# EasyEDA Pro project MiniVolter.eprj

# Schematic Schematic1
Board Name: Board1; Create Date: 2026-08-12; Page Name: P1; Project Name: MiniVolter; Schematic Name: Schematic1; Update Date: 2026-08-12; Company: EasyEDA.com; Page Size: A4; Version: V1.0
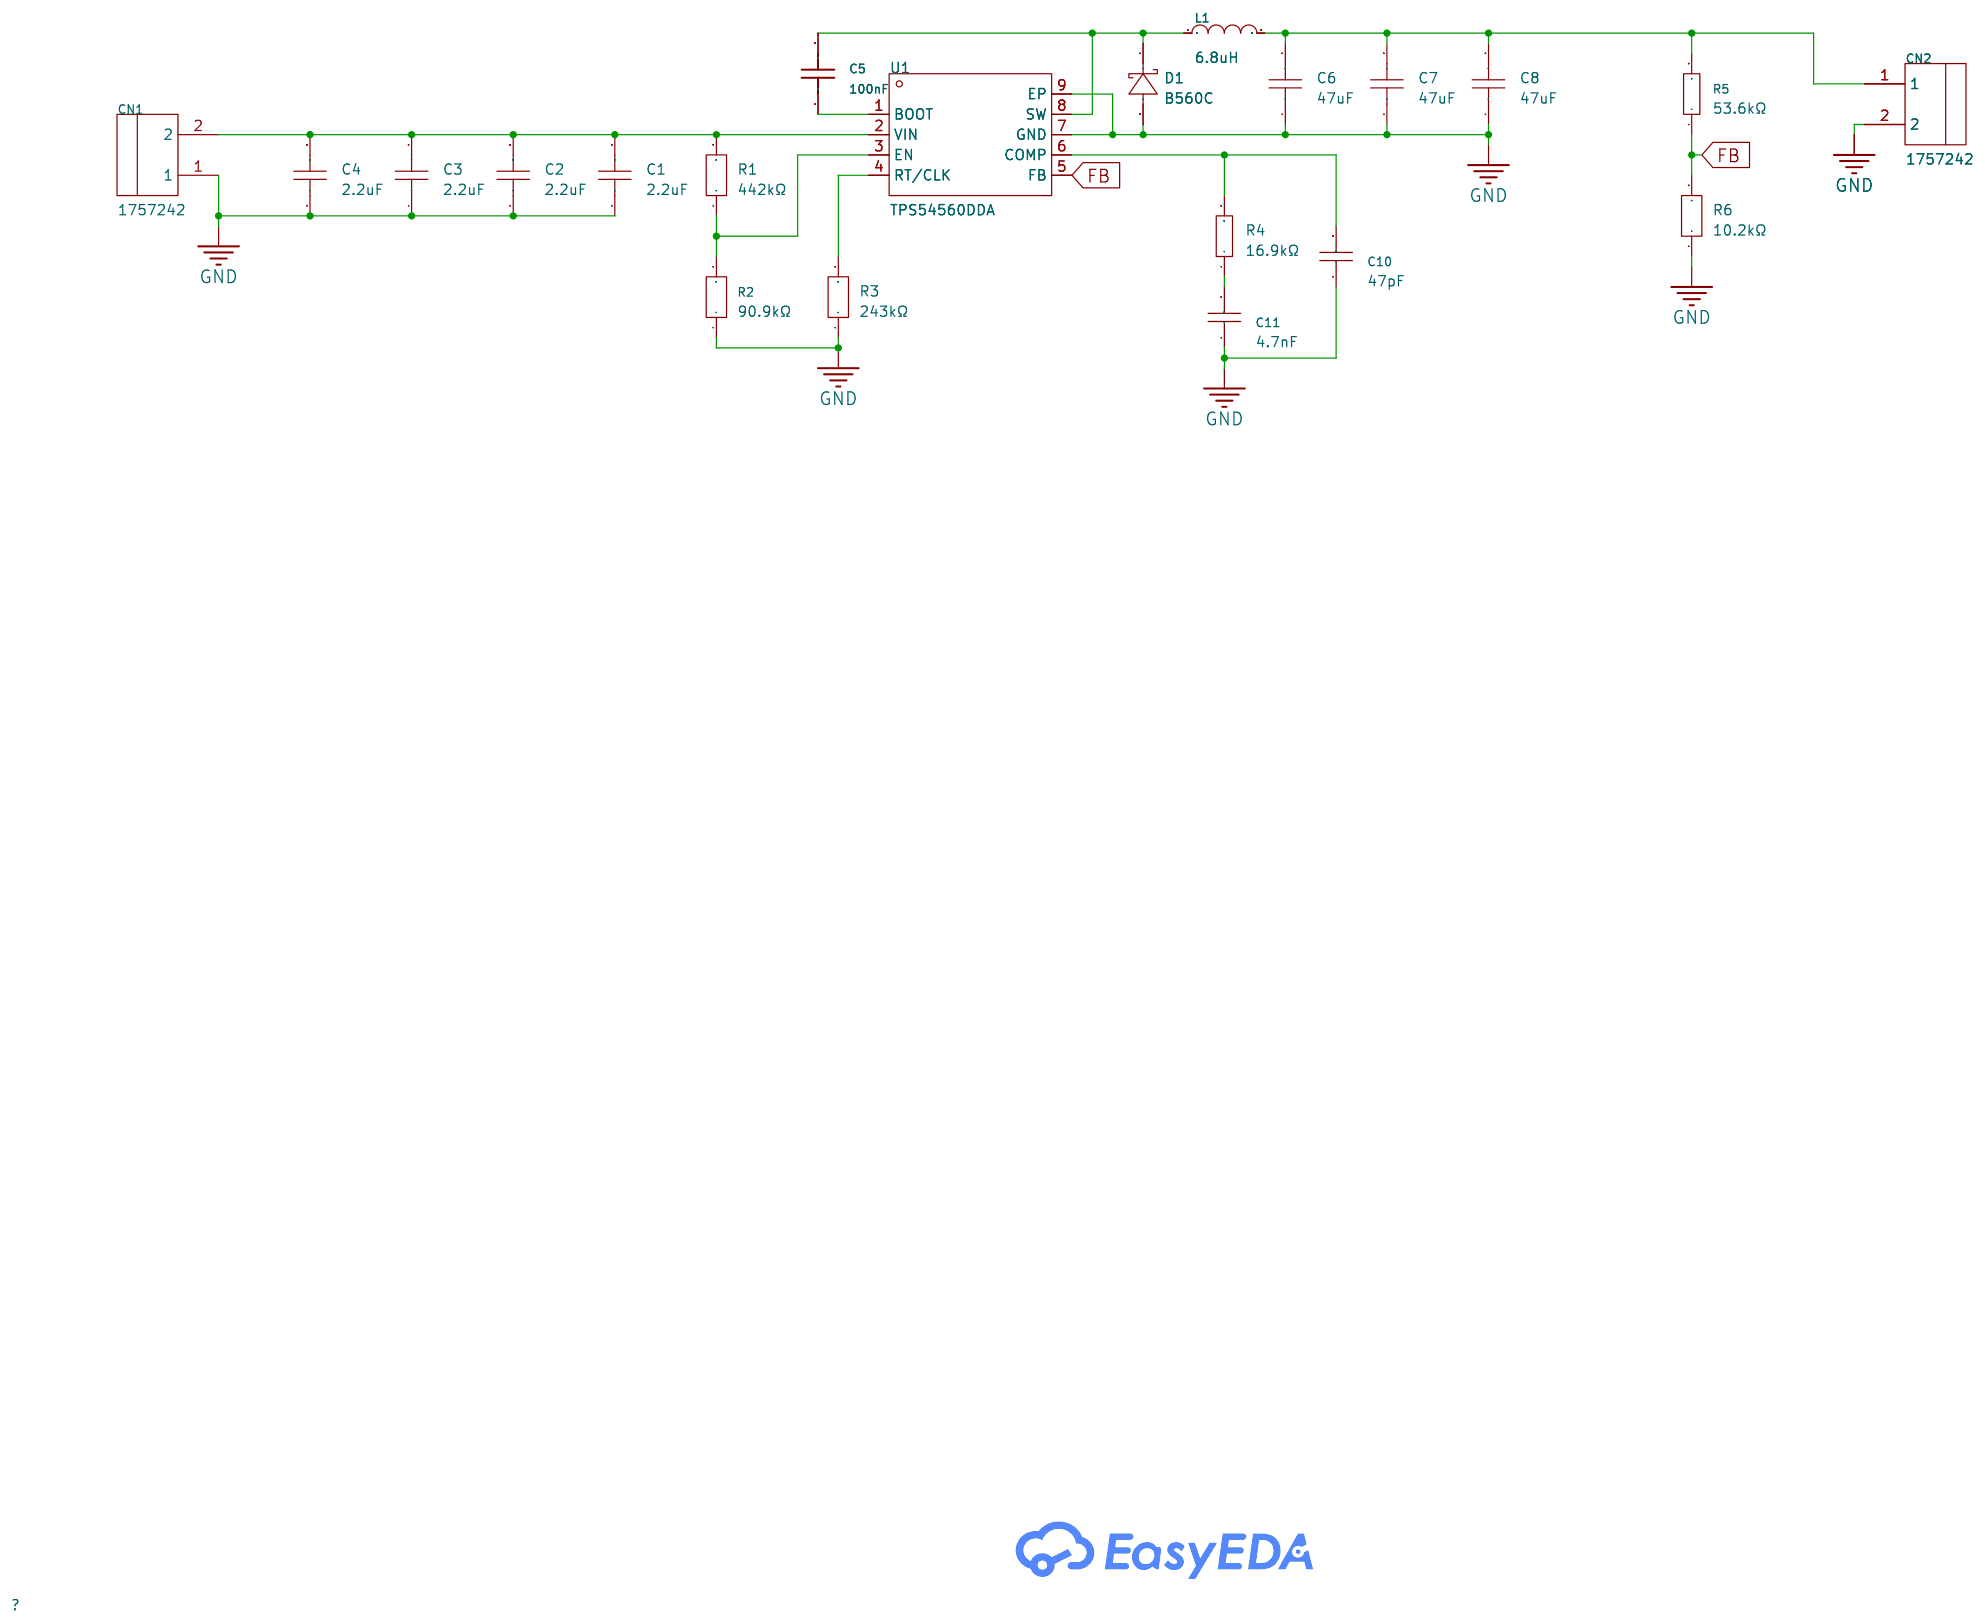
[diagram p0: schematic sheet]

## Parts
C1  2.2uF  [C1206]
C2  2.2uF  [C1206]
C3  2.2uF  [C1206]
C4  2.2uF  [C1206]
C5  100nF  [C0603]
C6  47uF  [C1210]
C7  47uF  [C1210]
C8  47uF  [C1210]
C10  47pF  [C0603]
C11  4.7nF  [C0603]
CN1  1757242  [CONN-TH_2P-P5.08_1757242]
CN2  1757242  [CONN-TH_2P-P5.08_1757242]
D1  B560C  [SMC_L6.9-W5.9-LS7.9-RD]
L1  6.8uH  [IND-SMD_L6.5-W6.5_VISHAY]
R1  442kΩ  [R0805]
R2  90.9kΩ  [R0603]
R3  243kΩ  [R0603]
R4  16.9kΩ  [R0603]
R5  53.6kΩ  [R0603]
R6  10.2kΩ  [R0603]
U1  TPS54560DDA  [SO-8_L4.9-W3.9-P1.27-LS6.0-BL-EP]

## Library data of the parts
C1-C4 = CC1206KKX7R0BB225: Capacitance:2.2uF Tolerance:±10% Tolerance:±10% Voltage Rating:100V Temperature Coefficient:X7R; LCSC Part Name: 2.2uF ±10% 100V; Supplier Part: C577211; Manufacturer: YAGEO(国巨); Supplier Footprint: 1206; JLCPCB Part Class: Extended Part; Datasheet: https://item.szlcsc.com/datasheet/CC1206KKX7R0BB225/604702.html; Supplier: LCSC; Tolerance: ±10%; Voltage Rating: 100V; Temperature Coefficient: X7R; Check: true
C5 = CC0603KRX7R9BB104: Capacitance:100nF Tolerance:±10% Tolerance:±10% Voltage Rating:50V Temperature Coefficient:X7R; LCSC Part Name: 100nF ±10% 50V; Supplier Part: C14663; Manufacturer: YAGEO(国巨); Supplier Footprint: 0603; JLCPCB Part Class: Basic Part; Datasheet: https://item.szlcsc.com/datasheet/CC0603KRX7R9BB104/15331.html; Supplier: LCSC; Tolerance: ±10%; Voltage Rating: 50V; Temperature Coefficient: X7R; Check: true
C6-C8 = HGC1210R5476M250NSVK: Capacitance:47uF Tolerance:±20% Tolerance:±20% Voltage Rating:25V Temperature Coefficient:X5R; LCSC Part Name: 47uF ±20% 25V; Supplier Part: C7432791; Manufacturer: Chinocera(华瓷); Supplier Footprint: 1210; JLCPCB Part Class: Extended Part; Datasheet: https://item.szlcsc.com/datasheet/HGC1210R5476M250NSVK/8438273.html; Supplier: LCSC; Tolerance: ±20%; Voltage Rating: 25V; Temperature Coefficient: X5R; Check: true
C10 = CC0603JRNPO9BN470: Capacitance:47pF Tolerance:±5% Tolerance:±5% Voltage Rating:50V Temperature Coefficient:NP0; LCSC Part Name: 47pF ±5% 50V; Supplier Part: C105622; Manufacturer: YAGEO(国巨); Supplier Footprint: 0603; JLCPCB Part Class: Extended Part; Datasheet: https://item.szlcsc.com/datasheet/CC0603JRNPO9BN470/106837.html; Supplier: LCSC; Tolerance: ±5%; Voltage Rating: 50V; Temperature Coefficient: NP0; Check: true
C11 = CL10B472KB8NNNC: Capacitance:4.7nF Tolerance:±10% Tolerance:±10% Voltage Rating:50V Temperature Coefficient:X7R; LCSC Part Name: 4.7nF ±10% 50V; Supplier Part: C1621; Manufacturer: SAMSUNG(三星); Supplier Footprint: 0603; JLCPCB Part Class: Extended Part; Datasheet: https://item.szlcsc.com/datasheet/CL10B472KB8NNNC/1973.html; Supplier: LCSC; Tolerance: ±10%; Voltage Rating: 50V; Temperature Coefficient: X7R; Check: true
CN1 CN2 = 1757242: Connector Type:Board Side/Socket - Closed Number of Positions or Pins:1x2P Pitch:5.08mm Color:Green Mounting Type:Right-Angle Number of Pins:2P Number of Rows:1 Number of PINs Per Row:2 Current Rating:15A Voltage Rating (Max):300V Operating Temperature:-; LCSC Part Name: 1x2P 5.08mm 排数:1 每排P数:2; Supplier Part: C90074; Manufacturer: Phoenix Contact(菲尼克斯); Supplier Footprint: 弯插,P=5.08mm; JLCPCB Part Class: Extended Part; Datasheet: https://item.szlcsc.com/datasheet/1757242/91259.html; Supplier: LCSC; Connector Type: Board Side/Socket - Closed; Number of Positions or Pins: 1x2P; Pitch: 5.08mm; Color: Green; Mounting Type: Right-Angle; Number of Pins: 2P; Number of Rows: 1; Number of PINs Per Row: 2; Current Rating: 15A; Voltage Rating (Max): 300V; Check: true
D1 = B560C_C6807784: Diode Configuration:Independent Voltage - Forward(Vf@If):700mV@5A Voltage - DC Reverse(Vr):60V Current - Rectified:5A Reverse Leakage Current (Ir):100uA@60V Operating Junction Temperature Range:-55℃~+150℃ Operating Junction Temperature Range:-55℃~+150℃; LCSC Part Name: 电压:60V 电流:5A; Supplier Part: C6807784; Manufacturer: FUXINSEMI(富芯森美); Supplier Footprint: SMC(DO-214AB); JLCPCB Part Class: Extended Part; Datasheet: https://item.szlcsc.com/datasheet/B560C/7769272.html; Supplier: LCSC; Diode Configuration: Independent; Voltage - Forward(Vf@If): 700mV@5A; Voltage - DC Reverse(Vr): 60V; Current - Rectified: 5A; Reverse Leakage Current (Ir): 100uA@60V; Operating Junction Temperature Range: -55℃~+150℃; Check: true
L1 = IHLP2525CZER6R8M01: Inductance: Tolerance:±20% Tolerance:±20% Rated Current: Saturation Current (Isat):8A DC Resistance (DCR): Type:- Ratings:-; LCSC Part Name: 6.8uH ±20% 8A; Supplier Part: C506575; Manufacturer: VISHAY(威世); Supplier Footprint: SMD,6.5x6.9mm; JLCPCB Part Class: Extended Part; Datasheet: https://atta.szlcsc.com/upload/public/pdf/source/20210401/C506575_71387701A40E754D8D9F35C81B417BBD.pdf; Supplier: LCSC; Tolerance: ±20%; Saturation Current (Isat): 8A; Check: true
R1 = FRC0805F4423TS: Type:Thick Film Resistor Resistance:442kΩ Tolerance:±1% Tolerance:±1% Power(Watts):125mW Voltage-Supply(Max):150V Temperature Coefficient:±100ppm/℃ Temperature Coefficient:±100ppm/℃ Operating Temperature:-55℃~+155℃ Operating Temperature:-55℃~+155℃; LCSC Part Name: 442kΩ ±1% 125mW 厚膜电阻; Supplier Part: C2999502; Manufacturer: FOJAN(富捷); Supplier Footprint: 0805; JLCPCB Part Class: Extended Part; Datasheet: https://item.szlcsc.com/datasheet/FRC0805F4423TS/3476942.html; Supplier: LCSC; Type: Thick Film Resistor; Tolerance: ±1%; Power(Watts): 125mW; Voltage-Supply(Max): 150V; Temperature Coefficient: ±100ppm/℃; Operating Temperature: -55℃~+155℃; Check: true
R2 = ERJ3EKF9092V: Type:Thick Film Resistor Resistance:90.9kΩ Tolerance:±1% Tolerance:±1% Power(Watts):100mW Voltage-Supply(Max):150V Temperature Coefficient:±100ppm/℃ Temperature Coefficient:±100ppm/℃ Operating Temperature:-55℃~+155℃ Operating Temperature:-55℃~+155℃; LCSC Part Name: 90.9kΩ ±1% 100mW 厚膜电阻; Supplier Part: C403390; Manufacturer: PANASONIC(松下); Supplier Footprint: 0603; JLCPCB Part Class: Extended Part; Datasheet: https://item.szlcsc.com/datasheet/ERJ3EKF9092V/389189.html; Supplier: LCSC; Type: Thick Film Resistor; Tolerance: ±1%; Power(Watts): 100mW; Voltage-Supply(Max): 150V; Temperature Coefficient: ±100ppm/℃; Operating Temperature: -55℃~+155℃; Check: true
R3 = FRC0603F2433TS: Type:Thick Film Resistor Resistance:243kΩ Tolerance:±1% Tolerance:±1% Power(Watts):100mW Voltage-Supply(Max):75V Temperature Coefficient:±100ppm/℃ Temperature Coefficient:±100ppm/℃ Operating Temperature:-55℃~+155℃ Operating Temperature:-55℃~+155℃; LCSC Part Name: 厚膜电阻 243kΩ ±1% 100mW; Supplier Part: C7467321; Manufacturer: FOJAN(富捷); Supplier Footprint: 0603; JLCPCB Part Class: Extended Part; Datasheet: https://item.szlcsc.com/datasheet/FRC0603F2433TS/8513937.html; Supplier: LCSC; Type: Thick Film Resistor; Tolerance: ±1%; Power(Watts): 100mW; Voltage-Supply(Max): 75V; Temperature Coefficient: ±100ppm/℃; Operating Temperature: -55℃~+155℃; Check: true
R4 = 0603WAF1692T5E: Type:Thick Film Resistor Resistance:16.9kΩ Tolerance:±1% Tolerance:±1% Power(Watts):100mW Voltage-Supply(Max):75V Temperature Coefficient:±100ppm/℃ Temperature Coefficient:±100ppm/℃ Operating Temperature:-55℃~+155℃ Operating Temperature:-55℃~+155℃; LCSC Part Name: 16.9kΩ ±1% 100mW 厚膜电阻; Supplier Part: C25954; Manufacturer: UNI-ROYAL(厚声); Supplier Footprint: 0603; JLCPCB Part Class: Extended Part; Datasheet: https://item.szlcsc.com/datasheet/0603WAF1692T5E/26697.html; Supplier: LCSC; Type: Thick Film Resistor; Tolerance: ±1%; Power(Watts): 100mW; Voltage-Supply(Max): 75V; Temperature Coefficient: ±100ppm/℃; Operating Temperature: -55℃~+155℃; Check: true
R5 = 0603WAF5362T5E: Type:Thick Film Resistor Resistance:53.6kΩ Tolerance:±1% Tolerance:±1% Power(Watts):100mW Voltage-Supply(Max):75V Temperature Coefficient:±100ppm/℃ Temperature Coefficient:±100ppm/℃ Operating Temperature:-55℃~+155℃ Operating Temperature:-55℃~+155℃; LCSC Part Name: 53.6kΩ ±1% 100mW 厚膜电阻; Supplier Part: C23074; Manufacturer: UNI-ROYAL(厚声); Supplier Footprint: 0603; JLCPCB Part Class: Extended Part; Datasheet: https://item.szlcsc.com/datasheet/0603WAF5362T5E/23801.html; Supplier: LCSC; Type: Thick Film Resistor; Tolerance: ±1%; Power(Watts): 100mW; Voltage-Supply(Max): 75V; Temperature Coefficient: ±100ppm/℃; Operating Temperature: -55℃~+155℃; Check: true
R6 = FRC0603F1022TS: Type:Thick Film Resistor Resistance:10.2kΩ Tolerance:±1% Tolerance:±1% Power(Watts):100mW Voltage-Supply(Max):75V Temperature Coefficient:±100ppm/℃ Temperature Coefficient:±100ppm/℃ Operating Temperature:-55℃~+155℃ Operating Temperature:-55℃~+155℃; LCSC Part Name: 10.2kΩ ±1% 100mW 厚膜电阻; Supplier Part: C2933125; Manufacturer: FOJAN(富捷); Supplier Footprint: 0603; JLCPCB Part Class: Extended Part; Supplier: LCSC; Type: Thick Film Resistor; Tolerance: ±1%; Power(Watts): 100mW; Voltage-Supply(Max): 75V; Temperature Coefficient: ±100ppm/℃; Operating Temperature: -55℃~+155℃; Check: true
U1 = TPS54560DDA: Function:Step-down type Voltage - Supply:4.5V~60V Voltage - Supply:4.5V~60V Output Voltage:800mV~58.8V Output Voltage:800mV~58.8V Output Current:5A Frequency - Switching:2.5MHz Frequency - Switching:2.5MHz Operating Temperature:-40℃~+150℃@(TJ) Operating T; LCSC Part Name: 降压型 5A 4.5V~60V; Supplier Part: C465738; Manufacturer: TI(德州仪器); Supplier Footprint: SO-8-EP; JLCPCB Part Class: Extended Part; Datasheet: https://www.ti.com/cn/lit/gpn/tps54560; Supplier: LCSC; Function: Step-down type; Voltage - Supply: 4.5V~60V; Output Voltage: 800mV~58.8V; Output Current: 5A; Frequency - Switching: 2.5MHz; Operating Temperature: -40℃~+150℃@(TJ); Synchronous Rectifier: No; Number of Outputs: 1; Topology: Buck; Quiescent Current: 146uA; Switch tube (built-in/external): Built-in; Output Type: Adjustable; Features: Light load efficient mode；External compensation；Frequency synchronization；Cycle-by-cycle current limiting; Check: true

## Nets
GND: C1.1 C2.1 C3.1 C4.1 C6.1 C7.1 C8.1 C10.1 C11.1 CN1.1 CN2.2 D1.2(A) R2.1 R3.1 R6.1 U1.7(GND) U1.9(EP)
FB: R5.1 R6.2 U1.5(FB)
$1N1641: C1.2 C2.2 C3.2 C4.2 CN1.2 R1.2 U1.2(VIN)
$1N1678: R1.1 R2.2 U1.3(EN)
$1N1699: R3.2 U1.4(RT/CLK)
$1N1756: C5.1 U1.1(BOOT)
$1N1862: C5.2 D1.1(K) L1.1 U1.8(SW)
$1N2055: C10.2 R4.2 U1.6(COMP)
$1N2081: C11.2 R4.1
$1N2317: C6.2 C7.2 C8.2 CN2.1 L1.2 R5.2

# Board PCB1
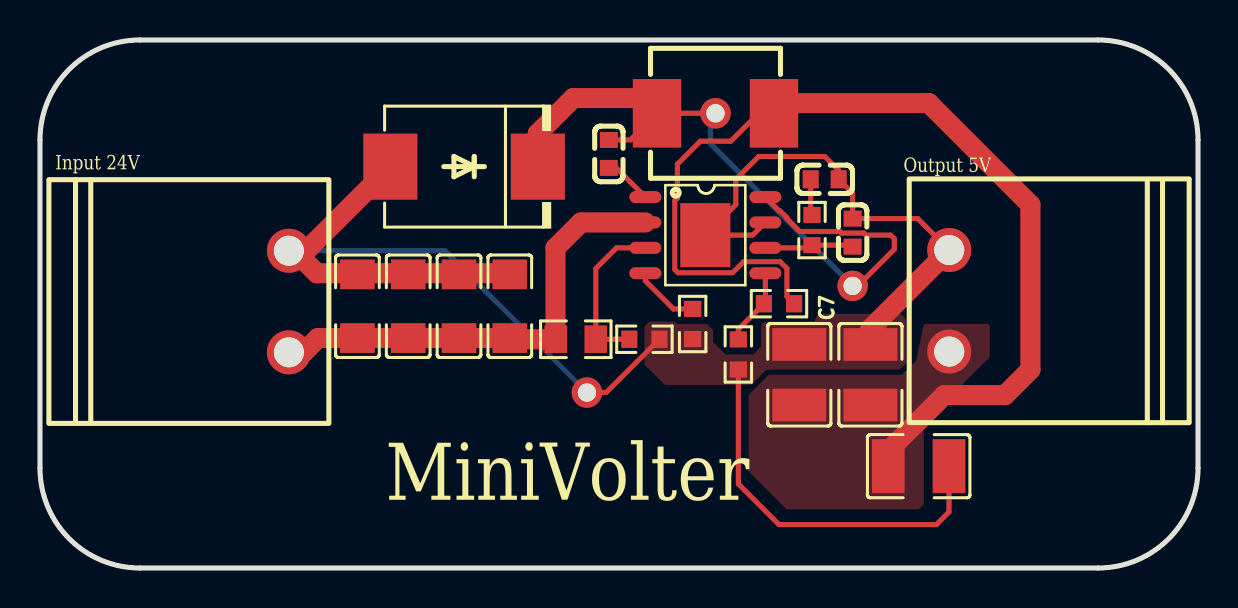
[diagram p1: board, top side]
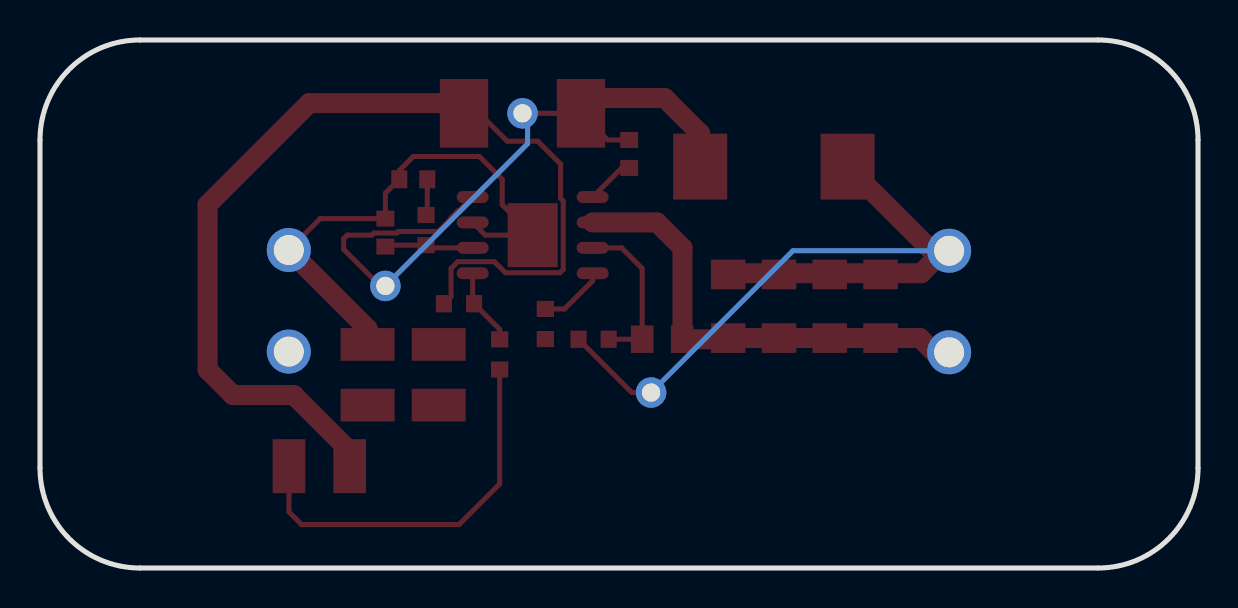
[diagram p2: board, bottom side, seen from below]

Outline 57.91 x 26.42 mm; copper layers: Top Layer, Bottom Layer. Coordinates in mm from the lower left corner of the outline.
Outline path: 0,21.42 0,5 arc(1.46,1.46) 5,0 52.91,0 arc(56.45,1.46) 57.91,5 57.91,21.42 arc(56.45,24.95) 52.91,26.42 5,26.42 arc(1.46,24.95) 0,21.42
Stack: Top Layer 0.035mm / Dielectric1 1.51mm FR4 er 4.5 / Bottom Layer 0.035mm

## Design rules (mm)
template: Custom Config
spacing copperThickness1oz (default): track to track 0.102, other pairs 0.152 to 0.3
spacing copperThickness2oz: track to track 0.203, other pairs 0.152 to 0.3
track width copperThickness1oz (default): min 0.127, default 0.254, max 2.54
track width copperThickness2oz: min 0.203, default 0.254, max 2.54
differential pair differentialPair (default): width min 0.127, default 0.254, max 2.54; gap min 0.152, default 0.152
via viaSize (default): diameter min 0.5, default 0.61, max 10; hole min 0.3, default 0.305, max 6.3
net GND uses copperRegion1

## Placement (name value [footprint] x y rotation side)
C1  2.2uF  [C1206]  23.5 13.1 270 top
C2  2.2uF  [C1206]  20.96 13.1 270 top
C3  2.2uF  [C1206]  18.41 13.1 270 top
C4  2.2uF  [C1206]  15.88 13.1 270 top
C5  100nF  [C0603]  28.45 20.72 90 top
C6  47uF  [C1210]  41.53 9.67 270 top
C7  47uF  [C1210]  37.97 9.67 270 top
C8  47uF  [C1210]  43.94 5.09 180 top
C10  47pF  [C0603]  40.64 16.78 270 top
C11  4.7nF  [C0603]  39.24 19.45 180 top
CN1  1757242  [CONN-TH_2P-P5.08_1757242]  12.45 13.33 270 top
CN2  1757242  [CONN-TH_2P-P5.08_1757242]  45.47 13.37 90 top
D1  B560C  [SMC_L6.9-W5.9-LS7.9-RD]  21.21 20.08 180 top
L1  6.8uH  [IND-SMD_L6.5-W6.5_VISHAY]  33.78 22.75 0 top
NOREF  -  [Pad_e252]  27.35 8.78 0 top
NOREF#2  -  [Pad_e364]  33.78 22.75 0 top
NOREF#3  -  [Pad_e296]  40.64 14.11 0 top
R1  442kΩ  [R0805]  26.8 11.45 180 top
R2  90.9kΩ  [R0603]  30.23 11.45 180 top
R3  243kΩ  [R0603]  32.64 12.21 90 top
R4  16.9kΩ  [R0603]  38.61 16.91 270 top
R5  53.6kΩ  [R0603]  36.96 13.22 0 top
R6  10.2kΩ  [R0603]  34.93 10.68 90 top
U1  TPS54560DDA  [SO-8_L4.9-W3.9-P1.27-LS6.0-BL-EP]  33.27 16.65 270 top

## Footprints (pads in the part's own frame, mm; a bottom-side part is the same pattern mirrored in y, then rotated)
C0603
  rect 0.8x0.9 smd: 1(-0.7,0) 2(0.7,0)
C1206
  rect 1.485x1.728 smd: 1(-1.593,0) 2(1.593,0)
C1210
  rect 1.635x2.7 smd: 1(-1.518,0) 2(1.518,0)
CONN-TH_2P-P5.08_1757242
  round 2.2 hole 1.5: 1(-2.54,0) 2(2.54,0)
IND-SMD_L6.5-W6.5_VISHAY
  rect 2.42x3.43 smd: 1(-2.925,0) 2(2.925,0)
Pad_e252
  round 1.524 hole 0.914: 1(0,0)
Pad_e296
  round 1.524 hole 0.914: 1(0,0)
Pad_e364
  round 1.524 hole 0.914: 1(0,0)
R0603
  rect 0.806x0.864 smd: 1(-0.753,0) 2(0.753,0)
R0805
  rect 1.133x1.377 smd: 1(-1,0) 2(1,0)
SMC_L6.9-W5.9-LS7.9-RD
  rect 2.7x3.3 smd: 1(-3.687,0) 2(3.687,0)
SO-8_L4.9-W3.9-P1.27-LS6.0-BL-EP
  oval 0.6x1.6 smd: 1(-1.905,-3) 2(-0.635,-3) 3(0.635,-3) 4(1.905,-3) 5(1.905,3) 6(0.635,3) 7(-0.635,3) 8(-1.905,3)
  rect 3.2x2.5 smd: 9(0,0)

## Nets
As in the schematic, except:
GND: C1.1 C2.1 C3.1 C4.1 C6.1 C7.1 C8.1 C10.1 C11.1 CN1.1 CN2.2 D1.2 NOREF.1 R2.1 R3.1 R6.1 U1.7 U1.9
$1N1862: C5.2 D1.1 L1.1 NOREF#2.1 NOREF#3.1 U1.8

## Routing (per net, layer and track width the routed paths; a pad name or vN(x,y) marks a point on that pad's centre or on a via; arc(x,y) is an arc through that point)
GND: length 87.2
  Top Layer w0.254: 27.56,8.78 28.31,8.78 R2.1 ; CN2.2 43.9,17.48 40.64,17.48 40.64,18.75 C11.1 39.94,19.89 39.24,20.59 35.94,20.59 34.8,19.45 34.8,18.18 U1.9 35.64,16.65 U1.7 ; R6.1 34.93,4.21 36.96,2.17 44.83,2.17 45.46,2.8 C8.1
  Top Layer w1: C1.1 23.44,14.75 13.84,14.75 12.72,15.87 ; CN2.2 41.53,11.97 C6.1 ; D1.2 13.31,15.87 12.72,15.87 ; 12.72,15.87 CN1.1
  Bottom Layer w0.254: NOREF.1 20.26,15.87 CN1.1
FB: length 3.9
  Top Layer w0.254: U1.5 36.27,13.29 R5.1 34.93,11.94 R6.2
$1N1641: length 23.7
  Top Layer w1: 23.06,11.5 23.12,11.45 R1.2 25.78,11.46 25.78,16.02 27.05,17.29 U1.2 ; 23.06,11.5 C1.2 ; 23.06,11.5 C2.2 C3.2 C4.2 13.9,11.5 13.19,10.79 CN1.2
$1N1678: length 8.1
  Top Layer w0.254: 30.27,16.02 28.83,16.02 27.8,14.98 R1.1 R2.2
$1N1699: length 3.3
  Top Layer w0.254: U1.4 30.27,14.37 31.68,12.96 R3.2
$1N1756: length 2.4
  Top Layer w0.254: U1.1 28.81,20.02 C5.1
$1N1862: length 36.5
  Top Layer w0.254: C5.2 29.53,21.42 L1.1 NOREF#2.1 ; 40.89,14.11 42.72,15.94 42.72,16.47 42.54,16.65 41.31,16.65 41.21,16.76 40.07,16.76 40,16.84 38,16.84 37.35,17.48 37.35,17.53 37.01,17.87 36.97,17.87 U1.8
  Top Layer w1: D1.1 24.9,21.74 26.67,23.51 30.1,23.51 L1.1
  Bottom Layer w0.254: 33.53,22.62 33.53,21.22 NOREF#3.1
$1N2055: length 4.5
  Top Layer w0.254: C10.2 40.57,16.15 R4.2 38.47,16.02 36.27,16.02
$1N2081: length 1.8
  Top Layer w0.254: R4.1 38.54,17.72 C11.2
$1N2317: length 52.1
  Top Layer w0.254: L1.2 35.94,22.75 34.54,21.35 33.02,21.35 31.88,20.21 31.88,18.5 31.75,18.37 31.75,14.94 31.91,14.77 34.64,14.77 35.19,15.33 37.01,15.33 37.35,14.99 37.35,13.58 R5.2
  Top Layer w1: L1.2 37.21,23.26 44.45,23.26 49.53,18.18 49.53,9.92 48.26,8.65 45.22,8.65 42.42,5.86 C8.2

## Copper pours and planes (outline as drawn; the poured copper is in the pictures)
GND on Top Layer: 30.48,12.33 30.23,12.08 30.23,10.18 31.24,9.16 35.69,9.16 36.45,9.92 43.05,9.92 43.31,10.18 43.31,12.46 43.05,12.72 38.89,12.72 38.73,12.33 36.35,12.33 36.07,12.21 36.07,11.09 35.66,10.68 34.29,10.68 33.66,11.32 33.66,11.91 33.36,12.21 31.88,12.21 31.75,12.33
$1N2317 on Top Layer: 44.2,12.21 43.81,10.37 43.11,9.67 36.44,9.67 35.43,8.66 35.43,4.84 37.34,2.94 43.94,2.94 44.2,3.19 44.2,7.25 47.5,10.56 47.5,12.21

## Text on the board
Top Silkscreen Layer: Input 24V | Output 5V | MiniVolter
